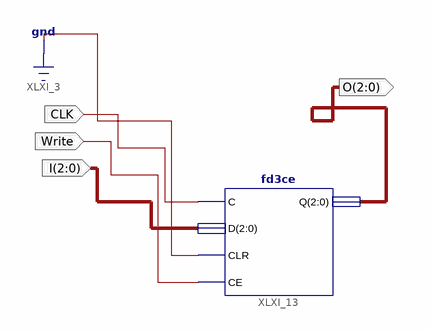
[diagram p0: schematic sheet 1]
// Xilinx ISE schematic reg3.sch (spartan3e) as structural Verilog: 1 symbols, 4 ports
module reg3 (
  input  Write,
  input  CLK,
  input  [2:0] I,
  output [2:0] O
);

  fd3ce XLXI_13 (.C(CLK), .D(I), .CLR(1'b0), .CE(Write), .Q(O));
endmodule
